# Altium schematic sheet Sheet1.SchDoc
size A4; DocumentNumber: 1; SheetNumber: 1; SheetTotal: 1
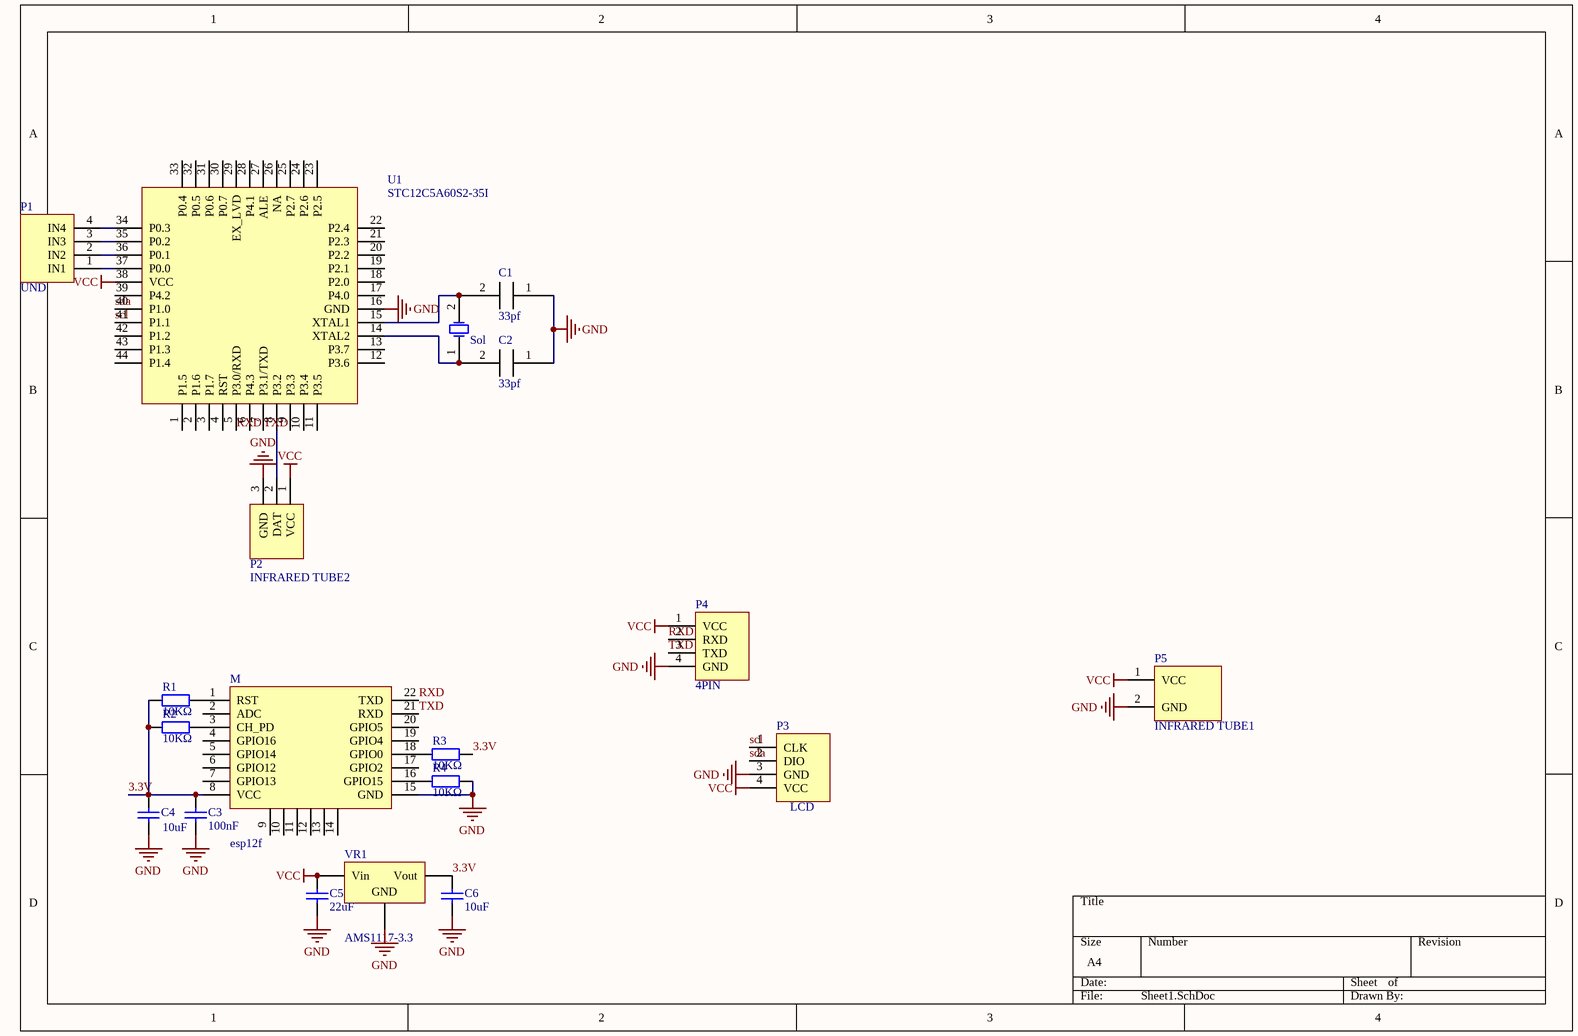
[diagram p0: Sheet1.SchDoc]

## Parts
C1  33pf  [C 0805_M]
C2  33pf  [C 0805_M]
C3  100nF  [0805_C]
C4  10uF  [0805_C]
C5  22uF  [0805_C]
C6  10uF  [0805_C]
M  esp12f  [ESP_12E]
P1  UND  [HDR2.54-LI-4P]
P2  INFRARED TUBE2  [XH2.54-LI-3P]
P3  LCD  [HDR2.54-M-LI-4P]
P4  4PIN  [HDR2.54-LI-4P]
P5  INFRARED TUBE1  [XH2.54-LI-2P]
R1  10KΩ  [0805_R]
R2  10KΩ  [0805_R]
R3  10KΩ  [0805_R]
R4  10KΩ  [0805_R]
Sol  CrystalOscillator  [OSC HC-49S]  (value not drawn)
U1  STC12C5A60S2-35I  [LQFP-44_10x10x08P]
VR1  AMS1117-3.3  [SOT-223]

## Nets
GND: C1.1 C2.1 C3.1 C4.1 C5.1 C6.1 M.15(GND) P2.3(GND) P3.3(GND) P4.4(GND) P5.2(GND) R4.2 U1.16(GND) VR1.1(GND)
VCC: C5.2 P2.1(VCC) P3.4(VCC) P4.1(VCC) P5.1(VCC) U1.38(VCC) VR1.3(Vin)
3.3V: C3.2 C4.2 C6.2 M.8(VCC) R1.1 R2.1 R3.2 VR1.2(Vout)
RXD: M.22(TXD) P4.2(RXD) U1.5(P3.0/RXD)
scl: P3.1(CLK) U1.41(P1.1)
sda: P3.2(DIO) U1.40(P1.0)
TXD: M.21(RXD) P4.3(TXD) U1.7(P3.1/TXD)
NetC1_2: C1.2 Sol.2(OSC2) U1.15(XTAL1)
NetC2_2: C2.2 Sol.1(OSC1) U1.14(XTAL2)
NetM_1: M.1(RST) R1.2
NetM_3: M.3(CH_PD) R2.2
NetM_16: M.16(GPIO15) R4.1
NetM_18: M.18(GPIO0) R3.1
NetP1_1: P1.1(IN1) U1.37(P0.0)
NetP1_2: P1.2(IN2) U1.36(P0.1)
NetP1_3: P1.3(IN3) U1.35(P0.2)
NetP1_4: P1.4(IN4) U1.34(P0.3)
NetP2_2: P2.2(DAT) U1.8(P3.2)

Not connected (* = marked no-connect by the designer): M 2(ADC) 4(GPIO16) 5(GPIO14) 6(GPIO12) 7(GPIO13) 9(_) 10(_) 11(_) 12(_) 13(_) 14(_) 17(GPIO2) 19(GPIO4) 20(GPIO5); U1 1(P1.5) 2(P1.6) 3(P1.7) 4(RST) 6(P4.3) 9(P3.3) 10(P3.4) 11(P3.5) 12(P3.6) 13(P3.7) 17(P4.0) 18(P2.0) 19(P2.1) 20(P2.2) 21(P2.3) 22(P2.4) 23(P2.5) 24(P2.6) 25(P2.7) 26(NA) 27(ALE) 28(P4.1) 29(EX_LVD) 30(P0.7) 31(P0.6) 32(P0.5) 33(P0.4) 39(P4.2) 42(P1.2) 43(P1.3) 44(P1.4)

## Library data of the parts
C1 C2 = 电容
C3 C5 C6 = 0805 100nF(104) 10% 50V: 贴片电容; ComponentLink1Description: 供应商链接; ComponentLink1URL: http://www.szlcsc.com/product/details_50686.html; Package: 0805; Supplier: LC; SuppliersPartNumber: C49678
C4 = 0805 10uF (106) 10% 25V: 贴片电容; ComponentLink1Description: 供应商链接; ComponentLink1URL: http://www.szlcsc.com/product/details_16532.html; Package: 0805; Supplier: LC; SuppliersPartNumber: C15850
P1 = 4PIN UND
P2 = INFRARED TUBE 2
R1-R4 = 0805 10KΩ (1002) 1%: 贴片电阻; ComponentLink1Description: 供应商链接; ComponentLink1URL: http://www.szlcsc.com/product/details_18102.html; Package: 0805; Supplier: LC; SuppliersPartNumber: C17414
Sol = XTAL: 晶振
U1 = STC12C5A60S2-35I: MCU; ComponentLink1Description: 供应商链接; ComponentLink1URL: http://www.szlcsc.com/product/details_9202.html; Package: LQFP-44_10x10x08P; Supplier: LC; SuppliersPartNumber: C8696
VR1 = SOT-223 AMS1117-3.3: 低压差线性稳压(LDO); ComponentLink1Description: 供应商链接; ComponentLink1URL: http://www.szlcsc.com/product/details_6652.html; Package: SOT-223; Supplier: LC; SuppliersPartNumber: C6186